# Altium project ECG_BLE.PrjPcb
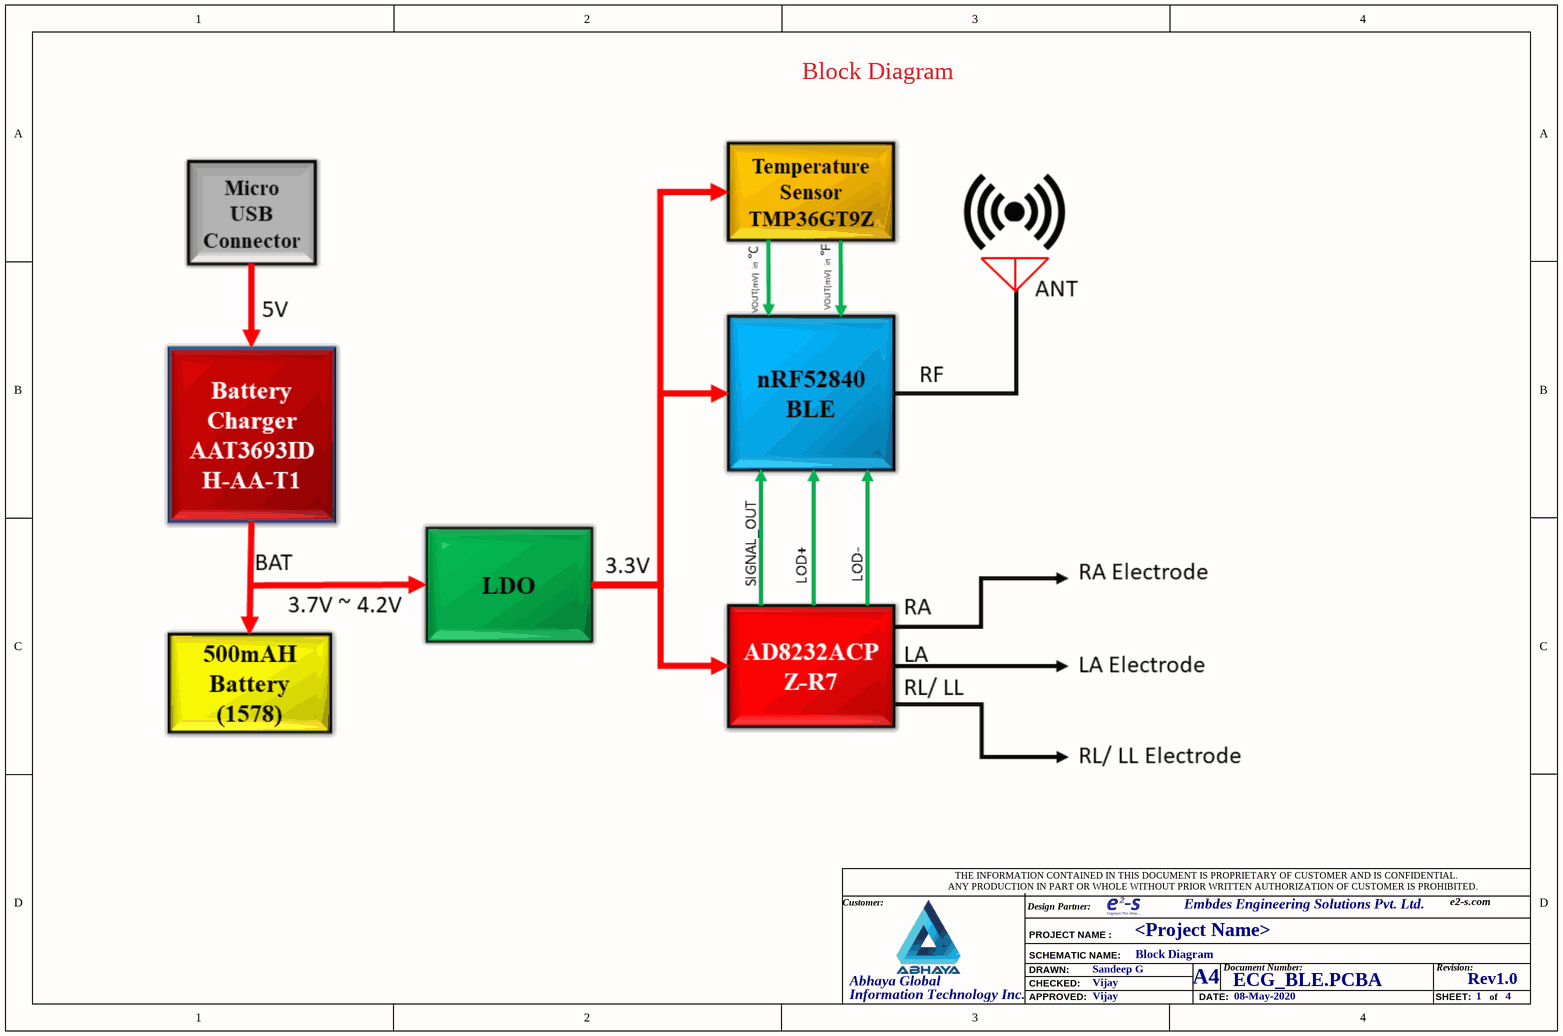
[diagram p0: Block Diagram.SchDoc]
4 sheets, 110 parts. Net scope: flat (ports and power ports of the same name join across sheets).
Board file: ECG_BLE.PcbDoc
Sheets:
  Block Diagram.SchDoc
  AD8232 & TMP136.SchDoc
  nRF52840.SchDoc
  USB & Battery Charging.SchDoc

## Sheet Block Diagram.SchDoc
size A4; Date: 08-May-2020; ApprovedBy: Vijay; CheckedBy: Vijay; CompanyName: Embdes Engineering Solutions Pvt. Ltd.; DrawnBy: Sandeep G; Organization: Altium Limited; Address1: e2-s.com; DocumentNumber: ECG_BLE.PCBA; Revision: Rev1.0; SheetNumber: 1; SheetTotal: 4; ApprovedByDate: <DATE>; CheckedByDate: <DATE>; DrawnByDate: <DATE>; PageName: Block Diagram; PageSetup: Record=PageOptions|CenterHorizontal=True|CenterVertical=True|PrintScale=0.71|XCorrection=1.00|YCorrection=1.00|PrintKind=1|BorderSize=5000000|LeftOffset=0|BottomOffset=0|Orientation=2|PaperLength=1000|PaperWidth=1000|Scale=100|PaperSource=15|PrintQuality=-4|MediaType=1|DitherType=10|PaperKind=Ledger.|PrintScaleMode=1; ProjectName: <Project Name>

### Notes on the sheet
- Block Diagram
- Customer:
- Design Partner:
- THE INFORMATION CONTAINED IN THIS DOCUMENT IS PROPRIETARY OF CUSTOMER AND IS CONFIDENTIAL.
- ANY PRODUCTION IN PART OR WHOLE WITHOUT PRIOR WRITTEN AUTHORIZATION OF CUSTOMER IS PROHIBITED.
- Abhaya Global
- DRAWN:
- CHECKED:
- PROJECT NAME :
- SCHEMATIC NAME:
- A4
- Document Number:
- Revision:
- Information Technology Inc.
- APPROVED:
- DATE:
- SHEET:
- of

## Sheet AD8232 & TMP136.SchDoc
size A4; Date: 08-May-2020; ApprovedBy: Vijay; CheckedBy: Vijay; CompanyName: Embdes Engineering Solutions Pvt. Ltd.; DrawnBy: Sandeep G; Organization: Altium Limited; Address1: e2-s.com; DocumentNumber: ECG_BLE.PCBA; Revision: Rev1.0; SheetNumber: 2; SheetTotal: 4; ApprovedByDate: <DATE>; CheckedByDate: <DATE>; DrawnByDate: <DATE>; PageName: AD8232 & TMP136; PageSetup: Record=PageOptions|CenterHorizontal=True|CenterVertical=True|PrintScale=0.71|XCorrection=1.00|YCorrection=1.00|PrintKind=1|BorderSize=5000000|LeftOffset=0|BottomOffset=0|Orientation=2|PaperLength=1000|PaperWidth=1000|Scale=100|PaperSource=15|PrintQuality=-4|MediaType=1|DitherType=10|PaperKind=Ledger.|PrintScaleMode=1; ProjectName: <Project Name>
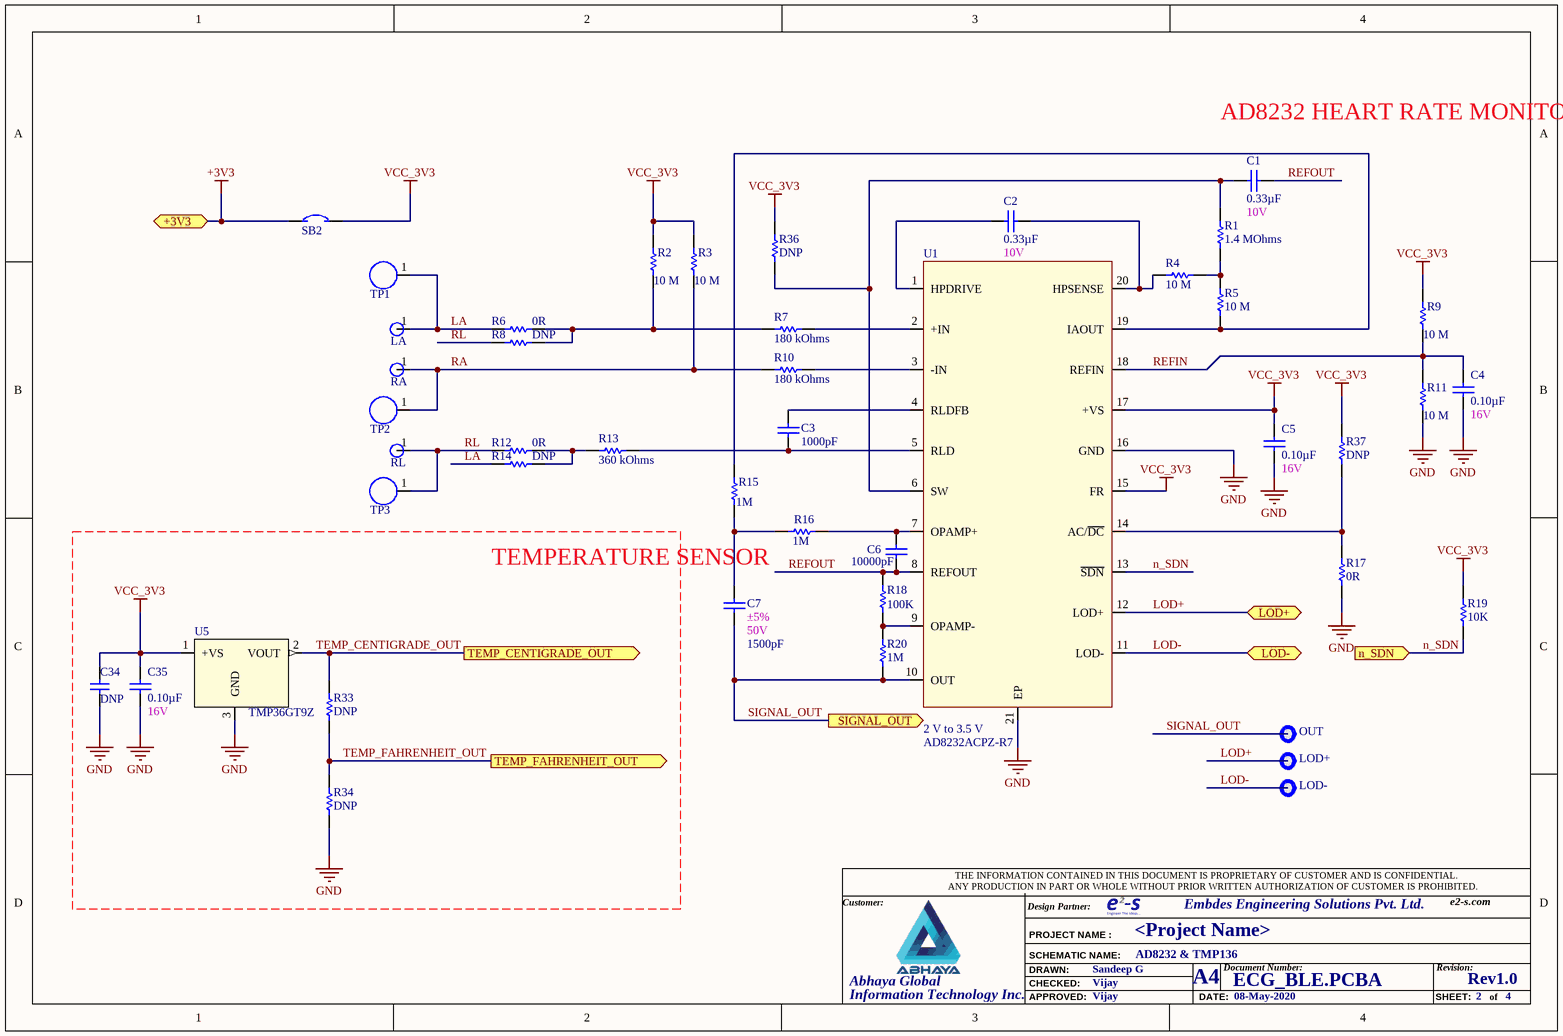
[diagram p1: AD8232 & TMP136.SchDoc]

### Parts
C1  value 0.33µF  1st Auxiliary Field: 10V  [SMDC0402]  (hidden comment: CAP CER 0.33UF 10V X5R 0402)
C2  value 0.33µF  1st Auxiliary Field: 10V  [SMDC0402]  (hidden comment: CAP CER 0.33UF 10V X5R 0402)
C3  value 1000pF  [SMDC0402]  (hidden comment: CAP CER 1000PF 50V X7R 0402)
C4  value 0.10µF  1st Auxiliary Field: 16V  [SMDC0402]  (hidden comment: CAP CER 0.1UF 16V X7R 0402)
C5  value 0.10µF  1st Auxiliary Field: 16V  [SMDC0402]  (hidden comment: CAP CER 0.1UF 16V X7R 0402)
C6  value 10000pF  [SMDCC0402]  (hidden comment: CAP CER 10000PF 50V X7R 0402)
C7  value 1500pF  2nd Auxiliary Field: ±5%  1st Auxiliary Field: 50V  [SMDC0402]  (hidden comment: CAP CER 1500PF 50V X7R 0402)
C34  value DNP  [SMDC0402]  (hidden comment: CAP CER 2.2UF 10V JB 0402)
C35  value 0.10µF  1st Auxiliary Field: 16V  [SMDC0402]  (hidden comment: CAP CER 0.1UF 16V X7R 0402)
LA  Test Point- 1.02mm Hole, 1.52mm Round Pad  [TP_1.02X1.52MM_TH]  (value not drawn)
LOD+  TEST POINT  [TP_40X40]  (value not drawn)
LOD-  TEST POINT  [TP_40X40]  (value not drawn)
OUT  TEST POINT  [TP_40X40]  (value not drawn)
R1  value 1.4 MOhms  [SMDR0402]  (hidden comment: RES 1.4M OHM 1% 1/16W 0402)
R2  value 10 M  [SMDR0402]  (hidden comment: RES SMD 10M OHM 5% 1/10W 0402)
R3  value 10 M  [SMDR0402]  (hidden comment: RES SMD 10M OHM 5% 1/10W 0402)
R4  value 10 M  [SMDR0402]  (hidden comment: RES SMD 10M OHM 5% 1/10W 0402)
R5  value 10 M  [SMDR0402]  (hidden comment: RES SMD 10M OHM 5% 1/10W 0402)
R6  value 0R  [SMDR0402]  (hidden comment: RES SMD 0.0OHM JUMPER 1/10W 0402)
R7  value 180 kOhms  [SMDR0402]  (hidden comment: RES SMD 180K OHM 1% 1/16W 0402)
R8  value DNP  [SMDR0402]  (hidden comment: RES SMD 0.0OHM JUMPER 1/10W 0402)
R9  value 10 M  [SMDR0402]  (hidden comment: RES SMD 10M OHM 5% 1/10W 0402)
R10  value 180 kOhms  [SMDR0402]  (hidden comment: RES SMD 180K OHM 1% 1/16W 0402)
R11  value 10 M  [SMDR0402]  (hidden comment: RES SMD 10M OHM 5% 1/10W 0402)
R12  value 0R  [SMDR0402]  (hidden comment: RES SMD 0.0OHM JUMPER 1/10W 0402)
R13  value 360 kOhms  [SMDR0402]  (hidden comment: RES SMD 360K OHM 1% 1/10W 0402)
R14  value DNP  [SMDR0402]  (hidden comment: RES SMD 0.0OHM JUMPER 1/10W 0402)
R15  value 1M  [SMDR0402]  (hidden comment: RES SMD 1M OHM 1% 1/10W 0402)
R16  value 1M  [SMDR0402]  (hidden comment: RES SMD 1M OHM 1% 1/10W 0402)
R17  value 0R  [SMDR0402]  (hidden comment: RES SMD 0.0OHM JUMPER 1/10W 0402)
R18  value 100K  [SMDRC0402]  (hidden comment: RES SMD 100K OHM 1% 1/10W 0402)
R19  value 10K  [SMDR0402]  (hidden comment: RES SMD 10K OHM 1% 1/10W 0402)
R20  value 1M  [SMDR0402]  (hidden comment: RES SMD 1M OHM 1% 1/10W 0402)
R33  value DNP  [SMDR0402]  (hidden comment: RES 45.3K OHM 0.5% 1/16W 0402)
R34  value DNP  [SMDR0402]  (hidden comment: RES SMD 10K OHM 0.5% 1/16W 0402)
R36  value DNP  [SMDR0402]  (hidden comment: RES SMD 0.0OHM JUMPER 1/10W 0402)
R37  value DNP  [SMDR0402]  (hidden comment: RES SMD 0.0OHM JUMPER 1/10W 0402)
RA  Test Point- 1.02mm Hole, 1.52mm Round Pad  [TP_1.02X1.52MM_TH]  (value not drawn)
RL  Test Point- 1.02mm Hole, 1.52mm Round Pad  [TP_1.02X1.52MM_TH]  (value not drawn)
SB2  EMS_SB0805  [SB_0805]  (value not drawn)  (net tie, no BOM)
TP1  Electrode point  [ELE-MH-6x8MM]  (value not drawn)
TP2  Electrode point  [ELE-MH-6x8MM]  (value not drawn)
TP3  Electrode point  [ELE-MH-6x8MM]  (value not drawn)
U1  value AD8232ACPZ-R7  1st Auxiliary Field: 2 V to 3.5 V  [QFN50P400X400X80_HS-21N]  (hidden comment: Analog Front End - AFE ECG and HRM IC Single Lead)
U5  value TMP36GT9Z  [TO-226-AA]  (hidden comment: SENSOR ANALOG -40C-125C TO92-3)

### Ports
+3V3, LOD+, LOD-, n_SDN (in), SIGNAL_OUT (out), TEMP_CENTIGRADE_OUT (out), TEMP_FAHRENHEIT_OUT (out)

### Nets
+3V3: SB2.1 ; port +3V3
GND: C4.1 C5.1 C34.1 C35.1 R11.1 R17.2 R34.1 U1.16(GND) U1.21(EP) U5.3(GND)
VCC_3V3: C5.2 C34.2 C35.2 R2.2 R3.2 R9.2 R19.1 R36.2 R37.1 SB2.2 U1.15(FR) U1.17(+VS) U5.1(+VS)
LA: LA.1 R6.1 R14.1 TP1.1
LOD+: LOD+.1 U1.12(LOD+) ; port LOD+
LOD-: LOD-.1 U1.11(LOD-) ; port LOD-
n_SDN: R19.2 U1.13(~{SDN}) ; port n_SDN
RA: R3.1 R10.1 RA.1 TP2.1
REFIN: C4.2 R9.1 R11.2 U1.18(REFIN)
REFOUT: C1.2 C6.1 R18.1 U1.8(REFOUT)
RL: R8.1 R12.1 RL.1 TP3.1
SIGNAL_OUT: C7.1 OUT.1 R20.2 U1.10(OUT) ; port SIGNAL_OUT
TEMP_CENTIGRADE_OUT: R33.2 U5.2(VOUT) ; port TEMP_CENTIGRADE_OUT
TEMP_FAHRENHEIT_OUT: R33.1 R34.2 ; port TEMP_FAHRENHEIT_OUT
NetC1_1: C1.1 R1.2 R36.1 U1.6(SW)
NetC2_1: C2.1 U1.1(HPDRIVE)
NetC2_2: C2.2 R4.2 U1.20(HPSENSE)
NetC3_1: C3.1 R13.2 U1.5(RLD)
NetC3_2: C3.2 U1.4(RLDFB)
NetC6_2: C6.2 R16.1 U1.7(OPAMP+)
NetC7_2: C7.2 R15.1 R16.2
NetR1_1: R1.1 R4.1 R5.1
NetR2_1: R2.1 R6.2 R7.1 R8.2
NetR5_2: R5.2 R15.2 U1.19(IAOUT)
NetR7_2: R7.2 U1.2(+IN)
NetR10_2: R10.2 U1.3(-IN)
NetR12_2: R12.2 R13.1 R14.2
NetR17_1: R17.1 R37.2 U1.14(AC/~{DC})
NetR18_2: R18.2 R20.1 U1.9(OPAMP-)

### Notes on the sheet
- AD8232 HEART RATE MONITOR
- TEMPERATURE SENSOR
- Customer:
- Design Partner:
- THE INFORMATION CONTAINED IN THIS DOCUMENT IS PROPRIETARY OF CUSTOMER AND IS CONFIDENTIAL.
- ANY PRODUCTION IN PART OR WHOLE WITHOUT PRIOR WRITTEN AUTHORIZATION OF CUSTOMER IS PROHIBITED.
- Abhaya Global
- DRAWN:
- CHECKED:
- PROJECT NAME :
- SCHEMATIC NAME:
- A4
- Document Number:
- Revision:
- Information Technology Inc.
- APPROVED:
- DATE:
- SHEET:
- of

### Library data of the parts
C1 C2 = ECA0U33L10V0-SB: Manufacturer: Samsung Electro-Mechanics; Manufacturer Part Number: CL05A334KP5NNNC; Vendor Part Number: 1276-6665-1-ND; Temp Co: -55°C ~ 85°C; 3rd Auxiliary Field: ROHS3 Compliant; Component Height (mm): 0.55mm; Vendor Name: Digi-Key; 2nd Auxiliary Field: ±10%; Internal Part Number: ECA0U33L10V0-SB; Part Type: CAP CER 0.33UF 10V X5R 0402; 4th Auxiliary Field: *
C3 = ECA1N00K50V0-SB: Manufacturer: KEMET; Manufacturer Part Number: C0402C102J5RACTU; Vendor Part Number: 399-7754-1-ND; Temp Co: -55°C ~ 125°C; 3rd Auxiliary Field: ROHS3 Compliant; Component Height (mm): 0.55mm; Vendor Name: Digi-Key; 2nd Auxiliary Field: ±5%; Internal Part Number: ECA1N00K50V0-SB; Part Type: CAP CER 1000PF 50V X7R 0402; 4th Auxiliary Field: *; 1st Auxiliary Field: 50V
C4 C5 C35 = ECA0U10K16V0-1-SB: Manufacturer: Samsung Electro-Mechanics America, Inc.; Manufacturer Part Number: CL05B104KO5NNNC; Vendor Part Number: 1276-1001-1-ND; Vendor Name: Digi-Key; 2nd Auxiliary Field: ±10%; Temp Co: X7R; Internal Part Number: ECA0U10K16V0-1-SB; 3rd Auxiliary Field: *; Component Height (mm): *; Part Type: CAP CER 0.1UF 16V X7R 0402; 4th Auxiliary Field: *
C6 = ECA10N0K50V0-SB: Manufacturer Part Number: C0402C103J5RACTU; Manufacturer: Samsung Electro-Mechanics America, Inc.; Vendor Part Number: 399-7758-1-ND; Component Height (mm): 0.55; 4th Auxiliary Field: RoHS Compliant; Vendor Name: Digi-Key; 2nd Auxiliary Field: ±5%; Internal Part Number: ECA10N0K50V0-SB; 3rd Auxiliary Field: *; Part Type: CAP CER 10000PF 50V X7R 0402; Temp Co: X7R; 1st Auxiliary Field: 50V
C7 = ECA1N50K50V0-SB: Manufacturer: Yageo; Vendor Part Number: 311-3763-1-ND; Manufacturer Part Number: CC0402JRX7R9BB152; Vendor Name: Digi-Key; 3rd Auxiliary Field: ROHS3 Compliant; Component Height (mm): 0.55mm; Temp Co: -55°C ~ 125°C; Part Type: CAP CER 1500PF 50V X7R 0402; Internal Part Number: ECA1N50K50V0-SB; 4th Auxiliary Field: *
C34 = ECA2U20L10V-SB: Manufacturer: TDK Corporation; Vendor Part Number: 445-10904-1-ND; Manufacturer Part Number: C1005JB1A225K050BC; 1st Auxiliary Field: 2.2µF; 3rd Auxiliary Field: RoHS Compliant; Component Height (mm): 0.55mm; Temperature Coefficient: -25°C ~ 85°C; Vendor Name: Digi-Key; 2nd Auxiliary Field: ±10%; Internal part Number: ECA2U20L10V-SB; Part Type: CAP CER 2.2UF 10V JB 0402; 4th Auxiliary Field: 10V
LA RA RL = EMS-TP_1X1.52MM_TH: Internal Part Number: EMS-TP_1X1.52MM_TH; Component Height (mm): *; Part Type: Test Point- 1.02mm Hole, 1.52mm Round Pad
LOD+ LOD- OUT = EMS-TP40X40-S: 1st Auxiliary Field: Black; Component Height (mm): *; Manufacturer: *; Part Type: TEST POINT; Manufacturer Part Number: *; Internal Part Number: EMS-TP40X40-S
R1 = ERE1M40G116-SB: Manufacturer: Stackpole Electronics Inc; Vendor Part Number: RMCF0402FT1M40CT-ND; Manufacturer Part Number: RMCF0402FT1M40; Vendor Name: Digi-Key; 3rd Auxiliary Field: ROHS3 Compliant; Component Height (mm): 0.40mm; Temp Co: -55°C ~ 155°C; 1st Auxiliary Field: 0.063W, 1/16W; Part Type: RES 1.4M OHM 1% 1/16W 0402; Internal Part Number: ERE1M40G116-SB; 4th Auxiliary Field: *; 2nd Auxiliary Field: ±1%
R2-R5 R9 R11 = ERE10M0K110-SB: Manufacturer Part Number: ERJ-2GEJ106X; Manufacturer: Panasonic Electronic Components; Vendor Part Number: P10MJCT-ND; 3rd Auxiliary Field: ROHS3 Compliant; Component Height (mm): 0.4mm; Temp Co: -55°C ~ 155°C; Vendor Name: Digi-Key; 1st Auxiliary Field: 0.1W; Internal Part Number: ERE10M0K110-SB; Part Type: RES SMD 10M OHM 5% 1/10W 0402; 4th Auxiliary Field: *; 2nd Auxiliary Field: ±5%
R6 R8 R12 R14 R17 R36 R37 = ERE0R00110-SB: Manufacturer: Panasonic Electronic Components; Vendor Part Number: P0.0JCT-ND; Manufacturer Part Number: ERJ-2GE0R00X; Vendor Name: Digi-Key; Component Height (mm): 0.40mm; 1st Auxiliary Field: 0.1W; Part Type: RES SMD 0.0OHM JUMPER 1/10W 0402; Internal Part Number: ERE0R00110-SB; Temp Co: *; 2nd Auxiliary Field: Jumper
R7 R10 = ERE180KG116-SB: Manufacturer: Yageo; Vendor Part Number: 311-180KLRCT-ND; Manufacturer Part Number: RC0402FR-07180KL; Vendor Name: Digi-Key; 3rd Auxiliary Field: ROHS3 Compliant; Component Height (mm): 0.40mm; Temp Co: -55°C ~ 155°C; 1st Auxiliary Field: 0.063W, 1/16W; Part Type: RES SMD 180K OHM 1% 1/16W 0402; Internal Part Number: ERE180KG116-SB; 4th Auxiliary Field: *; 2nd Auxiliary Field: ±1%
R13 = ERE360KG110-SB: Manufacturer: Panasonic Electronic Components; Vendor Part Number: P360KLCT-ND; Manufacturer Part Number: ERJ-2RKF3603X; Vendor Name: Digi-Key; 3rd Auxiliary Field: ROHS3 Compliant; Component Height (mm): 0.40mm; Temp Co: -55°C ~ 155°C; 1st Auxiliary Field: 0.1W, 1/10W; Part Type: RES SMD 360K OHM 1% 1/10W 0402; Internal Part Number: ERE360KG110-SB; 4th Auxiliary Field: *; 2nd Auxiliary Field: ±1%
R15 R16 R20 = ERE1M00G110-SB: Manufacturer Part Number: ERJ-2RKF1004X; Manufacturer: Panasonic Electronic Components; Vendor Part Number: P1.00MLCT-ND; Component Height (mm): 0.40mm; Temp Co: -55°C ~ 155°C; Vendor Name: Digi-Key; 1st Auxiliary Field: 0.1W; Internal Part Number: ERE1M00G110-SB; 3rd Auxiliary Field: *; Part Type: RES SMD 1M OHM 1% 1/10W 0402; 4th Auxiliary Field: *; 2nd Auxiliary Field: ±1%
R18 = ERE100KG110-SB: Manufacturer Part Number: ERJ-2RKF1003X; Manufacturer: Panasonic Electronic Components; Vendor Part Number: P100KLCT-ND; Component Height (mm): 0.40mm; Vendor Name: Digi-Key; Temp Co: ±100ppm/°C; 1st Auxiliary Field: 0.1W; Part Type: RES SMD 100K OHM 1% 1/10W 0402; 3rd Auxiliary Field: *; 4th Auxiliary Field: *; Internal Part Number: ERE100KG110-SB; 2nd Auxiliary Field: ±1%
R19 = ERE10K0G110-SB: Manufacturer: Panasonic Electronic Components; Manufacturer Part Number: ERJ-2RKF1002X; Vendor Part Number: P10.0KLCT-ND; Component Height (mm): 0.40mm; Vendor Name: Digi-Key; Temp Co: ±100ppm/°C; 1st Auxiliary Field: 0.1W; Part Type: RES SMD 10K OHM 1% 1/10W 0402; Internal Part Number: ERE10K0G110-SB; 2nd Auxiliary Field: ±1%
R33 = ERE45K3F116-SB: Manufacturer: Stackpole Electronics Inc; Vendor Part Number: RNCF0402DTE45K3CT-ND; Manufacturer Part Number: RNCF0402DTE45K3; Vendor Name: Digi-Key; 3rd Auxiliary Field: ROHS3 Compliant; Component Height (mm): 0.35mm; Temp Co: -55°C ~ 155°C; 1st Auxiliary Field: 0.063W, 1/16W; Part Type: RES 45.3K OHM 0.5% 1/16W 0402; Internal Part Number: ERE45K3F116-SB; 4th Auxiliary Field: *; 2nd Auxiliary Field: ±0.5%
R34 = ERE10K0F116-SB: Manufacturer: Panasonic Electronic Components; Vendor Part Number: P15984CT-ND; Manufacturer Part Number: ERJ-2RHD1002X; Vendor Name: Digi-Key; 3rd Auxiliary Field: ROHS3 Compliant; Component Height (mm): 0.40mm; Temp Co: -55°C ~ 125°C; 1st Auxiliary Field: 0.063W, 1/16W; Part Type: RES SMD 10K OHM 0.5% 1/16W 0402; Internal Part Number: ERE10K0F116-SB; 4th Auxiliary Field: *; 2nd Auxiliary Field: ±0.5%
SB2 = EMS_SB0805: *; Manufacturer: *; Part Type: *; Vendor Name: *; Vendor Part Number: *; 3rd Auxiliary Field: *; Manufacturer Part Number: *; Internal Part Number: EMS_SB0805; 4th Auxiliary Field: *; Component Height (mm): *; Temp Co: *; 2nd Auxiliary Field: *; 1st Auxiliary Field: *; Value: *
TP1-TP3 = EMS-ELE_6X8MM_TH: Internal Part Number: EMS-ELE_6X8MM_TH; Component Height (mm): *; Part Type: Electrode point
U1 = EICADLFCSP-20-1862: Manufacturer: Analog Devices; Vendor Part Number: 584-AD8232ACPZ-R7; 2nd Auxiliary Field: 170 uA; 3rd Auxiliary Field: RoHS Compliant; Component Height (mm): 0.8mm; Temp Co: -40°C ~ 85°C; Vendor Name: Mouser; 4th Auxiliary Field: *; Internal Part Number: EICADLFCSP-20-1862; Part Type: Analog Front End - AFE ECG and HRM IC Single Lead; Manufacturer Part Number: AD8232ACPZ-R7
U5 = EICADTO92-3-1865: Manufacturer: Analog Devices Inc.; Vendor Part Number: TMP36GT9Z-ND; 2nd Auxiliary Field: 10mV/°C; 3rd Auxiliary Field: RoHS Compliant; Component Height (mm): 18.03mm; Temp Co: 25°C (-40°C ~ 125°C); Vendor Name: Digi-Key; 1st Auxiliary Field: 2.7V ~ 5.5V; 4th Auxiliary Field: *; Internal Part Number: EICADTO92-3-1865; Part Type: SENSOR ANALOG -40C-125C TO92-3; Manufacturer Part Number: TMP36GT9Z

## Sheet nRF52840.SchDoc
size A4; Date: 08-May-2020; ApprovedBy: Vijay; CheckedBy: Vijay; CompanyName: Embdes Engineering Solutions Pvt. Ltd.; DrawnBy: Sandeep G; Organization: Altium Limited; Address1: e2-s.com; DocumentNumber: ECG_BLE.PCBA; Revision: Rev1.0; SheetNumber: 3; SheetTotal: 4; ApprovedByDate: <DATE>; CheckedByDate: <DATE>; DrawnByDate: <DATE>; PageName: nRF52840; PageSetup: Record=PageOptions|CenterHorizontal=True|CenterVertical=True|PrintScale=0.71|XCorrection=1.00|YCorrection=1.00|PrintKind=1|BorderSize=5000000|LeftOffset=0|BottomOffset=0|Orientation=2|PaperLength=1000|PaperWidth=1000|Scale=100|PaperSource=15|PrintQuality=-4|MediaType=1|DitherType=10|PaperKind=Ledger.|PrintScaleMode=1; ProjectName: <Project Name>
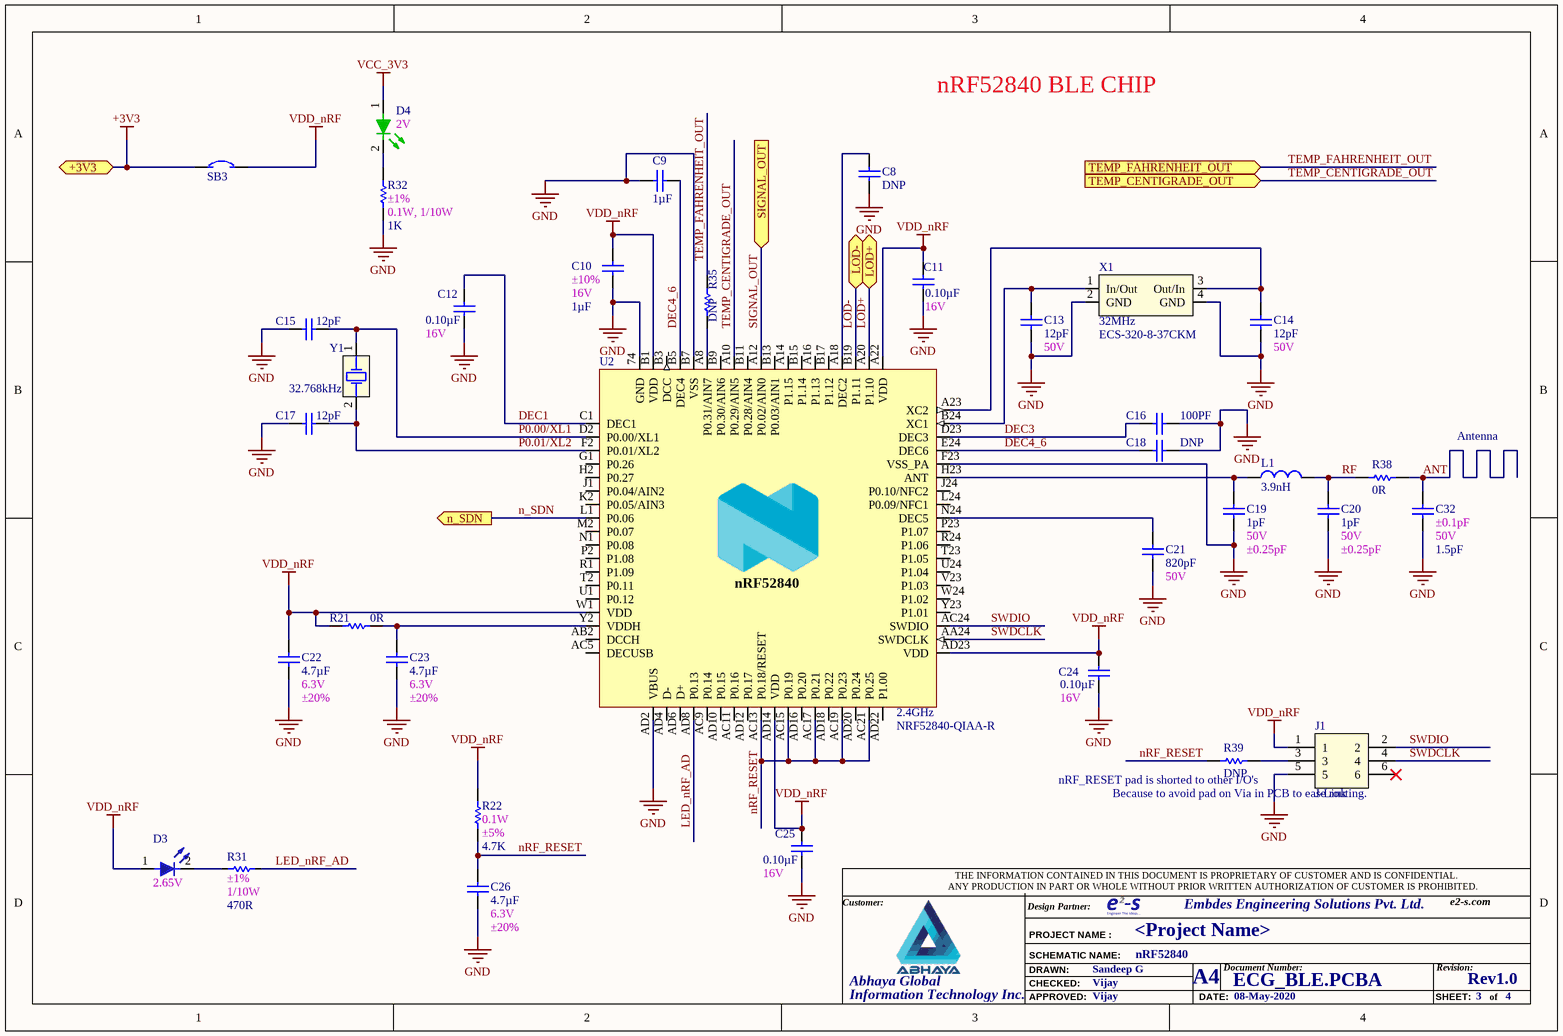
[diagram p2: nRF52840.SchDoc]

### Parts
C8  value DNP  [SMDC0402]  (hidden comment: CAP CER 100PF 25V X7RCAP CER 100PF 25V C0G/NP0 0402 0402)
C9  value 1µF  [SMDC0402]  (hidden comment: CAP CER 1UF 16V X5R 0402)
C10  value 1µF  2nd Auxiliary Field: ±10%  1st Auxiliary Field: 16V  [SMDC0402]  (hidden comment: CAP CER 1UF 16V X5R 0402)
C11  value 0.10µF  1st Auxiliary Field: 16V  [SMDC0402]  (hidden comment: CAP CER 0.1UF 16V X7R 0402)
C12  value 0.10µF  1st Auxiliary Field: 16V  [SMDC0402]  (hidden comment: CAP CER 0.1UF 16V X7R 0402)
C13  value 12pF  1st Auxiliary Field: 50V  [SMDC0402]  (hidden comment: CAP CER 12PF 50V C0G/NP0 0402)
C14  value 12pF  1st Auxiliary Field: 50V  [SMDC0402]  (hidden comment: CAP CER 12PF 50V C0G/NP0 0402)
C15  value 12pF  [SMDC0402]  (hidden comment: CAP CER 12PF 50V C0G/NP0 0402)
C16  value 100PF  [SMDC0402]  (hidden comment: CAP CER 100PF 25V X7RCAP CER 100PF 25V C0G/NP0 0402 0402)
C17  value 12pF  [SMDC0402]  (hidden comment: CAP CER 12PF 50V C0G/NP0 0402)
C18  value DNP  [SMDC0402]  (hidden comment: CAP CER 100PF 25V X7RCAP CER 100PF 25V C0G/NP0 0402 0402)
C19  value 1pF  1st Auxiliary Field: 50V  2nd Auxiliary Field: ±0.25pF  [SMDC0402]  (hidden comment: CAP CER 1PF 50V C0G/NP0 0402)
C20  value 1pF  1st Auxiliary Field: 50V  2nd Auxiliary Field: ±0.25pF  [SMDC0402]  (hidden comment: CAP CER 1PF 50V C0G/NP0 0402)
C21  value 820pF  1st Auxiliary Field: 50V  [SMDC0402]  (hidden comment: CAP CER 820PF 50V C0G/NP0 0402)
C22  value 4.7µF  1st Auxiliary Field: 6.3V  2nd Auxiliary Field: ±20%  [SMDC0402]  (hidden comment: CAP CER 4.7UF 6.3V X5R 0402)
C23  value 4.7µF  1st Auxiliary Field: 6.3V  2nd Auxiliary Field: ±20%  [SMDC0402]  (hidden comment: CAP CER 4.7UF 6.3V X5R 0402)
C24  value 0.10µF  1st Auxiliary Field: 16V  [SMDC0402]  (hidden comment: CAP CER 0.1UF 16V X7R 0402)
C25  value 0.10µF  1st Auxiliary Field: 16V  [SMDC0402]  (hidden comment: CAP CER 0.1UF 16V X7R 0402)
C26  value 4.7µF  1st Auxiliary Field: 6.3V  2nd Auxiliary Field: ±20%  [SMDC0402]  (hidden comment: CAP CER 4.7UF 6.3V X5R 0402)
C32  value 1.5pF  2nd Auxiliary Field: ±0.1pF  1st Auxiliary Field: 50V  [SMDC0402]  (hidden comment: CAP CER 1.5PF 50V NP0 0402)
D3  1st Auxiliary Field: 2.65V  [SMDLED0603]  (hidden comment: LED BLUE CLEAR 2SMD)
D4  1st Auxiliary Field: 2V  [SMDLED0603]  (hidden comment: LED GREEN CLEAR SMD)
J1  1st Auxiliary Field: J-Link  [PRG_8.06.16 J-LINK 6-PIN NEEDLE ADAPTER]  (hidden comment: J-LINK 6-PIN NEEDLE ADAPTER)
L1  value 3.9nH  [SMDL0402]  (hidden comment: FIXED IND 3.9NH 170MA 500 MOHM)
R21  value 0R  [SMDR0402]  (hidden comment: RES SMD 0.0OHM JUMPER 1/10W 0402)
R22  value 4.7K  1st Auxiliary Field: 0.1W  2nd Auxiliary Field: ±5%  [SMDR0402]  (hidden comment: RES SMD 4.7K OHM 5% 1/10W 0402)
R31  value 470R  1st Auxiliary Field: ±1%  2nd Auxiliary Field: 1/10W  [SMDR0402]  (hidden comment: RES SMD 470 OHM 1% 1/10W 0402)
R32  value 1K  2nd Auxiliary Field: ±1%  1st Auxiliary Field: 0.1W, 1/10W  [SMDR0402]  (hidden comment: RES SMD 1K OHM 1% 1/10W 0402)
R35  value DNP  [SMDR0402]  (hidden comment: RES SMD 0.0OHM JUMPER 1/10W 0402)
R38  value 0R  [SMDR0402]  (hidden comment: RES SMD 0.0OHM JUMPER 1/10W 0402)
R39  value DNP  [SMDR0402]  (hidden comment: RES SMD 0.0OHM JUMPER 1/10W 0402)
SB3  EMS_SB0805  [SB_0805]  (value not drawn)  (net tie, no BOM)
U2  value NRF52840-QIAA-R  1st Auxiliary Field: 2.4GHz  [AQFN50P700X700X85_HS-74N]  (hidden comment: IC RF TXRX+MCU 802.15.4 73VFQFN)
X1  value ECS-320-8-37CKM  1st Auxiliary Field: 32MHz  [XTAL200X160X50-4N]  (hidden comment: CRYSTAL 32.0000MHZ 8PF SMD)
Y1  1st Auxiliary Field: 32.768kHz  [XTAL325X155X80N]  (hidden comment: CRYSTAL 32.7680KHZ 12.5PF SMD)

### Ports
+3V3, LOD+, LOD-, n_SDN (out), SIGNAL_OUT (in), TEMP_CENTIGRADE_OUT (in), TEMP_FAHRENHEIT_OUT (in)

### Nets
+3V3: SB3.1 ; port +3V3
GND: C8.2 C9.1 C10.1 C11.1 C12.1 C13.1 C14.1 C15.1 C16.2 C17.1 C18.2 C19.1 C20.1 C21.1 C22.1 C23.1 C24.1 C25.1 C26.1 C32.1 J1.5 R32.2 U2.74(GND) U2.AD2(VBUS) U2.B7(VSS) U2.F23(VSS_PA) X1.2(GND) X1.4(GND)
VCC_3V3: D4.1(A)
VDD_nRF: C10.2 C11.2 C22.2 C24.2 C25.2 D3.1(A) J1.1 R21.1 R22.2 SB3.2 U2.A22(VDD) U2.AD14(VDD) U2.AD23(VDD) U2.B1(VDD) U2.W1(VDD)
ANT: C32.2 R38.2
DEC1: C12.2 U2.C1(DEC1)
DEC3: C16.1 U2.D23(DEC3)
DEC4_6: C9.2 C18.1 U2.B5(DEC4) U2.E24(DEC6)
LED_nRF_AD: R31.1 U2.AD8(P0.13)
LOD+: U2.A20(P1.10) ; port LOD+
LOD-: U2.B19(P1.11) ; port LOD-
n_SDN: U2.L1(P0.06) ; port n_SDN
nRF_RESET: C26.2 R22.1 R39.1 U2.AC13(P0.18/RESET) U2.AC15(P0.19) U2.AC17(P0.21) U2.AC19(P0.23) U2.AC21(P0.25)
P0.00/XL1: C15.2 U2.D2(P0.00/XL1) Y1.1
P0.01/XL2: C17.2 U2.F2(P0.01/XL2) Y1.2
RF: C20.2 L1.2 R38.1
SIGNAL_OUT: U2.A12(P0.02/AIN0) ; port SIGNAL_OUT
SWDCLK: J1.4 U2.AA24(SWDCLK)
SWDIO: J1.2 U2.AC24(SWDIO)
TEMP_CENTIGRADE_OUT: U2.A10(P0.29/AIN5) ; port TEMP_CENTIGRADE_OUT
TEMP_FAHRENHEIT_OUT: R35.2 ; port TEMP_FAHRENHEIT_OUT
NetC8_1: C8.1 U2.A18(DEC2)
NetC13_2: C13.2 U2.B24(XC1) X1.1(In/Out)
NetC14_2: C14.2 U2.A23(XC2) X1.3(Out/In)
NetC19_2: C19.2 L1.1 U2.H23(ANT)
NetC21_2: C21.2 U2.N24(DEC5)
NetC23_2: C23.2 R21.2 U2.Y2(VDDH)
NetD3_2: D3.2(K) R31.2
NetD4_2: D4.2(K) R32.1
NetJ1_3: J1.3 R39.2
NetR35_1: R35.1 U2.A8(P0.31/AIN7)

Not connected (* = marked no-connect by the designer): J1 6*; U2 A14(P1.15) A16(P1.13) AB2(DCCH) AC5(DECUSB) AC9(P0.14) AC11(P0.16) AD4(D-) AD6(D+) AD10(P0.15) AD12(P0.17) AD16(P0.20) AD18(P0.22) AD20(P0.24) AD22(P1.00) B3(DCC) B9(P0.30/AIN6) B11(P0.28/AIN4) B13(P0.03/AIN1) B15(P1.14) B17(P1.12) G1(P0.26) H2(P0.27) J1(P0.04/AIN2) J24(P0.10/NFC2) K2(P0.05/AIN3) L24(P0.09/NFC1) M2(P0.07) N1(P0.08) P2(P1.08) P23(P1.07) R1(P1.09) R24(P1.06) T2(P0.11) T23(P1.05) U1(P0.12) U24(P1.04) V23(P1.03) W24(P1.02) Y23(P1.01)

### Notes on the sheet
- nRF52840 BLE CHIP
- Antenna
- nRF_RESET pad is shorted to other I/O's
- (near C25) Because to avoid pad on Via in PCB to ease routing.
- Customer:
- Design Partner:
- THE INFORMATION CONTAINED IN THIS DOCUMENT IS PROPRIETARY OF CUSTOMER AND IS CONFIDENTIAL.
- ANY PRODUCTION IN PART OR WHOLE WITHOUT PRIOR WRITTEN AUTHORIZATION OF CUSTOMER IS PROHIBITED.
- Abhaya Global
- DRAWN:
- CHECKED:
- PROJECT NAME :
- SCHEMATIC NAME:
- A4
- Document Number:
- Revision:
- Information Technology Inc.
- APPROVED:
- DATE:
- SHEET:
- of
- (in symbol EICNSVFQFN-73-1863) nRF52840

### Library data of the parts
C8 C18 = ECA100P0K25V0-SB: CAP CER 100PF 25V C0G/NP0 0402; Manufacturer: KEMET; Vendor Part Number: 399-1022-1-ND; Vendor Name: Digi-Key; 3rd Auxiliary Field: ROHS3 Compliant; Component Height (mm): 0.55mm; Temp Co: -55°C ~ 125°C; 2nd Auxiliary Field: ±5%; Part Type: CAP CER 100PF 25V C0G/NP0 0402; Manufacturer Part Number: DNP; Internal Part Number: ECA100P0K25V0-SB; 1st Auxiliary Field: 25V
C9 = ECA1U00L16V0-SB: Manufacturer: Samsung Electro-Mechanics; Vendor Part Number: 1276-1067-1-ND; Manufacturer Part Number: CL05A105KO5NNNC; Vendor Name: Digi-Key; 3rd Auxiliary Field: RoHS Compliant; Component Height (mm): 0.55MM; 2nd Auxiliary Field: ±10%; Part Type: CAP CER 1UF 16V X5R 0402; Internal Part Number: ECA1U00L16V0-SB; 4th Auxiliary Field: *; Temp Co: X5R; 1st Auxiliary Field: 16V
C10 = ECA1U00L16V0-SB: Manufacturer: Samsung Electro-Mechanics; Vendor Part Number: 1276-1067-1-ND; Manufacturer Part Number: CL05A105KO5NNNC; Vendor Name: Digi-Key; 3rd Auxiliary Field: RoHS Compliant; Component Height (mm): 0.55MM; Part Type: CAP CER 1UF 16V X5R 0402; Internal Part Number: ECA1U00L16V0-SB; 4th Auxiliary Field: *; Temp Co: X5R
C11 C12 C24 C25 = ECA0U10K16V0-1-SB: as C4 on sheet AD8232 & TMP136; Temp Co: X7R; Internal Part Number: ECA0U10K16V0-1-SB; 3rd Auxiliary Field: *; Component Height (mm): *; Part Type: CAP CER 0.1UF 16V X7R 0402; 4th Auxiliary Field: *
C13-C15 C17 = ECA12P0K50V0-SB: Manufacturer: KEMET; Manufacturer Part Number: CBR04C120J5GAC; Vendor Part Number: 399-6169-1-ND; Temp Co: -55°C ~ 125°C; 3rd Auxiliary Field: RoHS Compliant; Component Height (mm): 0.55mm; Vendor Name: Digi-Key; 2nd Auxiliary Field: ±5%; Internal Part Number: ECA12P0K50V0-SB; Part Type: CAP CER 12PF 50V C0G/NP0 0402; 4th Auxiliary Field: *
  C15 C17: 1st Auxiliary Field: 50V
C16 = ECA100P0K25V0-SB: CAP CER 100PF 25V C0G/NP0 0402; Manufacturer: KEMET; Vendor Part Number: 399-1022-1-ND; Manufacturer Part Number: C0402C101J3GACTU; Vendor Name: Digi-Key; 3rd Auxiliary Field: ROHS3 Compliant; Component Height (mm): 0.55mm; Temp Co: -55°C ~ 125°C; 2nd Auxiliary Field: ±5%; Part Type: CAP CER 100PF 25V C0G/NP0 0402; Internal Part Number: ECA100P0K25V0-SB; 1st Auxiliary Field: 25V
C19 C20 = ECA1P00V50V0-SB: Manufacturer: Samsung Electro-Mechanics; Manufacturer Part Number: CL05C010CB5NNNC; Vendor Part Number: 1276-1595-1-ND; Temp Co: -55°C ~ 125°C; 3rd Auxiliary Field: RoHS Compliant; Component Height (mm): 0.55mm; Vendor Name: Digi-Key; Internal Part Number: ECA1P00V50V0-SB; Part Type: CAP CER 1PF 50V C0G/NP0 0402; 4th Auxiliary Field: *
C21 = ECA820PK50V0-SB: Manufacturer: Samsung Electro-Mechanics; Manufacturer Part Number: CL05C821JB5NNNC; Vendor Part Number: 1276-1727-1-ND; Temp Co: -55°C ~ 125°C; 3rd Auxiliary Field: ROHS3 Compliant; Component Height (mm): 0.55mm; Vendor Name: Digi-Key; 2nd Auxiliary Field: ±5%; Internal Part Number: ECA820PK50V0-SB; Part Type: CAP CER 820PF 50V C0G/NP0 0402; 4th Auxiliary Field: *
C22 C23 C26 = ECA4U70N6V30-SB: Manufacturer: Murata Electronics North America; Manufacturer Part Number: GRM155R60J475ME47D; Vendor Part Number: 490-5915-1-ND; Temp Co: -55°C ~ 85°C; 3rd Auxiliary Field: RoHS Compliant; Component Height (mm): 0.60mm; Vendor Name: Digi-Key; Internal Part Number: ECA4U70N6V30-SB; Part Type: CAP CER 4.7UF 6.3V X5R 0402; 4th Auxiliary Field: *
C32 = ECA1P50D50V0-SB: Manufacturer: Murata Electronics North America; Vendor Part Number: 490-8087-1-ND; Manufacturer Part Number: GJM1555C1H1R5BB01D; Vendor Name: Digi-Key; Temp Co: C0G, NP0; Part Type: CAP CER 1.5PF 50V NP0 0402; 3rd Auxiliary Field: *; Internal Part Number: ECA1P50D50V0-SB; 4th Auxiliary Field: *; Component Height (mm): *
D3 = ELDB2V652M00-SC: Manufacturer: Kingbright; Vendor Part Number: 754-1933-1-ND; Manufacturer Part Number: APT1608LVBC/D; Vendor Name: Digi-Key; 2nd Auxiliary Field: 2mA; 3rd Auxiliary Field: RoHS Compliant; Component Height (mm): 0.75mm; Value: APT1608LVBC/D; Part Type: LED BLUE CLEAR 2SMD; Internal Part Number: ELDB2V652M00-SC; 4th Auxiliary Field: *; Temp Co: *
D4 = ELDG2V0020M0-SC: Manufacturer: Lite-On Inc.; Vendor Part Number: 160-1446-1-ND; Manufacturer Part Number: LTST-C191KGKT; Vendor Name: Digi-Key; 2nd Auxiliary Field: 20mA; 3rd Auxiliary Field: RoHS Compliant; Component Height (mm): 0.55mm; Value: LTST-C191KGKT; Part Type: LED GREEN CLEAR SMD; Internal Part Number: ELDG2V0020M0-SC; 4th Auxiliary Field: *; Temp Co: *
J1 = EMS-8.06.16 J-LINK 6-PIN NEEDLE ADAPTER: Manufacturer: Segger Microcontroller Systems; Vendor Part Number: 899-1051-ND; 3rd Auxiliary Field: RoHS Compliant; Vendor Name: Digi-Key; 2nd Auxiliary Field: *; 4th Auxiliary Field: *; Internal Part Number: EMS-8.06.16 J-LINK 6-PIN NEEDLE ADAPTER; Part Type: J-LINK 6-PIN NEEDLE ADAPTER; Temp Co: *; Manufacturer Part Number: 8.06.16 J-LINK 6-PIN NEEDLE ADAPTER; Value: 8.06.16 J-LINK 6-PIN NEEDLE ADAPTER
L1 = EIN3N90T170M-SB: Manufacturer Part Number: LQP15MN3N9B02D; Manufacturer: Murata Electronics North America; Vendor Part Number: 490-1131-1-ND; 3rd Auxiliary Field: RoHS Compliant; Component Height (mm): 0.45mm; Temp Co: -40°C ~ 85°C; Vendor Name: Digi-Key; 2nd Auxiliary Field: 500 mOhm Max; Internal Part Number: EIN3N90T170M-SB; Part Type: FIXED IND 3.9NH 170MA 500 MOHM; 4th Auxiliary Field: *; 1st Auxiliary Field: 170mA
R21 R35 R38 = ERE0R00110-SB: as R6 on sheet AD8232 & TMP136; Part Type: RES SMD 0.0OHM JUMPER 1/10W 0402; Internal Part Number: ERE0R00110-SB; Temp Co: *; 2nd Auxiliary Field: Jumper
R22 = ERE4K70J110-SB: Manufacturer Part Number: ERJ-2GEJ472X; Manufacturer: Panasonic Electronic Components; Vendor Part Number: P4.7KJCT-ND; Component Height (mm): 0.40mm; Temp Co: ±200ppm/°C; Vendor Name: Digi-Key; Internal Part Number: ERE4K70J110-SB; 3rd Auxiliary Field: *; Part Type: RES SMD 4.7K OHM 5% 1/10W 0402; 4th Auxiliary Field: *
R31 = ERE470RG110-SB: Manufacturer Part Number: ERJ-2RKF4700X; Manufacturer: Panasonic Electronic Components; Vendor Part Number: P470LCT-ND; Component Height (mm): 0.40mm; Temp Co: ±100ppm/°C; Vendor Name: Digi-Key; 3rd Auxiliary Field: *; Internal Part Number: ERE470RG110-SB; Part Type: RES SMD 470 OHM 1% 1/10W 0402; 4th Auxiliary Field: *
R32 = ERE1K00G110-SB_1: Manufacturer: Panasonic Electronic Components; Vendor Part Number: P1.00KLCT-ND; Manufacturer Part Number: ERJ-2RKF1001X; Vendor Name: Digi-Key; 3rd Auxiliary Field: RoHS Compliant; Component Height (mm): 0.40mm; Temp Co: ±100ppm/°C; Part Type: RES SMD 1K OHM 1% 1/10W 0402; Internal Part Number: ERE1K00G110-SB
R39 = ERE0R00110-SB: Manufacturer: Panasonic Electronic Components; Vendor Part Number: P0.0JCT-ND; Vendor Name: Digi-Key; Component Height (mm): 0.40mm; 1st Auxiliary Field: 0.1W; Part Type: RES SMD 0.0OHM JUMPER 1/10W 0402; Manufacturer Part Number: DNP; Internal Part Number: ERE0R00110-SB; Temp Co: *; 2nd Auxiliary Field: Jumper
SB3 = EMS_SB0805: *; Manufacturer: *; Part Type: *; Vendor Name: *; Vendor Part Number: *; 3rd Auxiliary Field: *; Manufacturer Part Number: *; Internal Part Number: EMS_SB0805; 4th Auxiliary Field: *; Component Height (mm): *; Temp Co: *; 2nd Auxiliary Field: *; 1st Auxiliary Field: *; Value: *
U2 = EICNSVFQFN-73-1863: Manufacturer: Nordic Semiconductor ASA; Vendor Part Number: 1490-1071-1-ND; 2nd Auxiliary Field: 1.7V ~ 5.5V; 3rd Auxiliary Field: ROHS3 Compliant; 4th Auxiliary Field: 2Mbps; Component Height (mm): 0.85mm; Temp Co: -40°C ~ 85°C; Vendor Name: Digi-Key; Internal Part Number: EICNSVFQFN-73-1863; Part Type: IC RF TXRX+MCU 802.15.4 73VFQFN; Manufacturer Part Number: NRF52840-QIAA-R
X1 = EMS-ECS-320-8-37CKM: Manufacturer: ECS Inc.; Vendor Part Number: XC1547CT-ND; 3rd Auxiliary Field: RoHS Compliant; Component Height (mm): 0.55mm; Temp Co: -20°C ~ 70°C; Vendor Name: Digi-Key; 2nd Auxiliary Field: 8pF; 4th Auxiliary Field: *; Internal Part Number: EMS-ECS-320-8-37CKM; Part Type: CRYSTAL 32.0000MHZ 8PF SMD; Manufacturer Part Number: ECS-320-8-37CKM
Y1 = EMS-ABS07-32.768KHZ-T: Manufacturer: Abracon LLC; Vendor Part Number: 535-9542-1-ND; 2nd Auxiliary Field: ±20ppm; 3rd Auxiliary Field: RoHS Compliant; Component Height (mm): 0.9mm; Temp Co: -40°C ~ 85°C; Vendor Name: Digi-Key; 4th Auxiliary Field: *; Internal Part Number: EMS-ABS07-32.768KHZ-T; Part Type: CRYSTAL 32.7680KHZ 12.5PF SMD; Manufacturer Part Number: ABS07-32.768KHZ-T; Value: ABS07-32.768KHZ-T

## Sheet USB & Battery Charging.SchDoc
size A4; Date: 08-May-2020; ApprovedBy: Vijay; CheckedBy: Vijay; CompanyName: Embdes Engineering Solutions Pvt. Ltd.; DrawnBy: Sandeep G; Organization: Altium Limited; Address1: e2-s.com; DocumentNumber: ECG_BLE.PCBA; Revision: Rev1.0; SheetNumber: 4; SheetTotal: 4; ApprovedByDate: <DATE>; CheckedByDate: <DATE>; DrawnByDate: <DATE>; PageName: USB & Battery Charging; PageSetup: Record=PageOptions|CenterHorizontal=True|CenterVertical=True|PrintScale=0.71|XCorrection=1.00|YCorrection=1.00|PrintKind=1|BorderSize=5000000|LeftOffset=0|BottomOffset=0|Orientation=2|PaperLength=1000|PaperWidth=1000|Scale=100|PaperSource=15|PrintQuality=-4|MediaType=1|DitherType=10|PaperKind=Ledger.|PrintScaleMode=1; ProjectName: <Project Name>
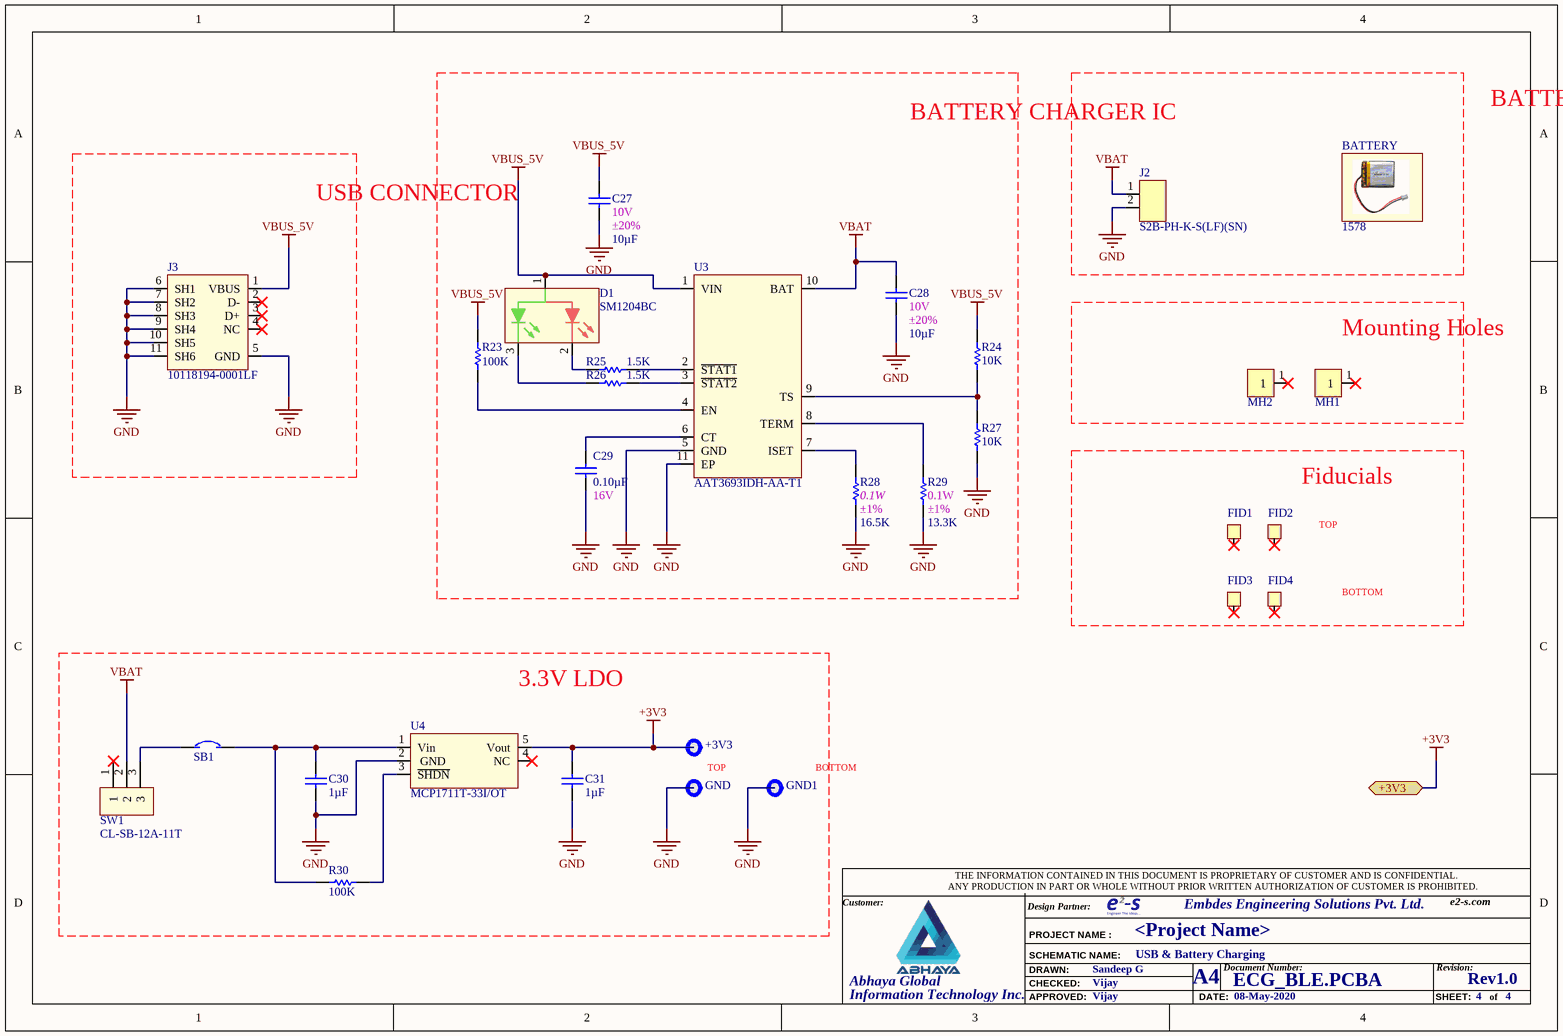
[diagram p3: USB & Battery Charging.SchDoc]

### Parts
+3V3  TEST POINT  [TP_40X40]  (value not drawn)
BATTERY  value 1578  (hidden comment: BATTERY LITHIUM 3.7V 500MAH)  (graphical)
C27  value 10µF  1st Auxiliary Field: 10V  2nd Auxiliary Field: ±20%  [SMDC0402]  (hidden comment: CAP CER 10UF 10V X5R 0402)
C28  value 10µF  1st Auxiliary Field: 10V  2nd Auxiliary Field: ±20%  [SMDC0402]  (hidden comment: CAP CER 10UF 10V X5R 0402)
C29  value 0.10µF  1st Auxiliary Field: 16V  [SMDC0402]  (hidden comment: CAP CER 0.1UF 16V X7R 0402)
C30  value 1µF  [SMDC0402]  (hidden comment: CAP CER 1UF 16V X5R 0402)
C31  value 1µF  [SMDC0402]  (hidden comment: CAP CER 1UF 16V X5R 0402)
D1  value SM1204BC  [LED-SM1204BC]  (hidden comment: LED GREEN/RED CLEAR 1204 SMD R/A)
FID1  FID40X40  [FID40X40]  (value not drawn)
FID2  FID40X40  [FID40X40]  (value not drawn)
FID3  FID40X40  [FID40X40]  (value not drawn)
FID4  FID40X40  [FID40X40]  (value not drawn)
GND  TEST POINT  [TP_40X40]  (value not drawn)
GND1  TEST POINT  [TP_40X40]  (value not drawn)
J2  value S2B-PH-K-S(LF)(SN)  [SHDRRA2W70P0_200_1X2_590X790X550P]  (hidden comment: CONN HOUSING PH 2POS 2MM WHITE)
J3  value 10118194-0001LF  [USB_MICRO_B_10118194-0001LF]  (hidden comment: CONN USB MICRO B RECPT SMT R/A)
MH1  Mounting hole  [MH_2P2MM_3P6KP]  (value not drawn)
MH2  Mounting hole  [MH_2P2MM_3P6KP]  (value not drawn)
R23  value 100K  [SMDRC0402]  (hidden comment: RES SMD 100K OHM 1% 1/10W 0402)
R24  value 10K  [SMDR0402]  (hidden comment: RES SMD 10K OHM 1% 1/10W 0402)
R25  value 1.5K  [SMDR0402]  (hidden comment: RES SMD 1.5K OHM 1% 1/10W 0402)
R26  value 1.5K  [SMDR0402]  (hidden comment: RES SMD 1.5K OHM 1% 1/10W 0402)
R27  value 10K  [SMDR0402]  (hidden comment: RES SMD 10K OHM 1% 1/10W 0402)
R28  value 16.5K  1st Auxiliary Field: 0.1W  2nd Auxiliary Field: ±1%  [SMDR0402]  (hidden comment: RES SMD 16.5K OHM 1% 1/10W 0402)
R29  value 13.3K  1st Auxiliary Field: 0.1W  2nd Auxiliary Field: ±1%  [SMDR0402]  (hidden comment: RES SMD 13.3K OHM 1% 1/10W 0402)
R30  value 100K  [SMDRC0402]  (hidden comment: RES SMD 100K OHM 1% 1/10W 0402)
SB1  EMS_SB0805  [SB_0805]  (value not drawn)  (net tie, no BOM)
SW1  value CL-SB-12A-11T  [SWITCH_CLSB12A11T]  (hidden comment: SWITCH SLIDE SPDT 200MA 12V)
U3  value AAT3693IDH-AA-T1  [SON40P220X220x80_HS-11N]  (hidden comment: 1.6A LINEAR LI-ION CHGR 10TDFN)
U4  Manufacturer Part Number: MCP1711T-33I/OT  [SOT95P350X145-5N]  (hidden comment: IC REG LINEAR 3.3V 150MA SOT23-5)

### Ports
+3V3

### Nets
+3V3: +3V3.1 C31.2 U4.5(Vout) ; port +3V3
GND: C27.2 C28.2 C29.1 C30.1 C31.1 GND.1 GND1.1 J2.2 J3.5(GND) J3.6(SH1) J3.7(SH2) J3.8(SH3) J3.9(SH4) J3.10(SH5) J3.11(SH6) R27.2 R28.1 R29.2 U3.5(GND) U3.11(EP) U4.2(GND)
VBAT: C28.1 J2.1 SW1.2 U3.10(BAT)
VBUS_5V: C27.1 D1.1(A) J3.1(VBUS) R23.1 R24.1 U3.1(VIN)
NetC29_2: C29.2 U3.6(CT)
NetC30_2: C30.2 R30.2 SB1.2 U4.1(Vin)
NetD1_2: D1.2(K) R25.2
NetD1_3: D1.3(K) R26.2
NetR23_2: R23.2 U3.4(EN)
NetR24_2: R24.2 R27.1 U3.9(TS)
NetR25_1: R25.1 U3.2(~{STAT1})
NetR26_1: R26.1 U3.3(~{STAT2})
NetR28_2: R28.2 U3.7(ISET)
NetR29_1: R29.1 U3.8(TERM)
NetR30_1: R30.1 U4.3(~{SHDN})
NetSB1_1: SB1.1 SW1.3

Not connected (* = marked no-connect by the designer): FID1 0*; FID2 0*; FID3 0*; FID4 0*; J3 2(D-)* 3(D+)* 4(NC)*; MH1 1*; MH2 1*; SW1 1*; U4 4(NC)*

### Notes on the sheet
- (near BATTERY) BATTERY & BATTERY CONNECTOR
- BATTERY CHARGER IC
- USB CONNECTOR
- Mounting Holes
- Fiducials
- (near FID2) TOP
- (near FID4) BOTTOM
- 3.3V LDO
- TOP
- (near GND1) BOTTOM
- Customer:
- Design Partner:
- THE INFORMATION CONTAINED IN THIS DOCUMENT IS PROPRIETARY OF CUSTOMER AND IS CONFIDENTIAL.
- ANY PRODUCTION IN PART OR WHOLE WITHOUT PRIOR WRITTEN AUTHORIZATION OF CUSTOMER IS PROHIBITED.
- Abhaya Global
- DRAWN:
- CHECKED:
- PROJECT NAME :
- SCHEMATIC NAME:
- A4
- Document Number:
- Revision:
- Information Technology Inc.
- APPROVED:
- DATE:
- SHEET:
- of

### Library data of the parts
+3V3 GND GND1 = EMS-TP40X40-S: 1st Auxiliary Field: Black; Component Height (mm): *; Manufacturer: *; Part Type: TEST POINT; Manufacturer Part Number: *; Internal Part Number: EMS-TP40X40-S
BATTERY = EMS-1578: Manufacturer: Adafruit Industries LLC; Vendor Part Number: 1528-1841-ND; 4th Auxiliary Field: 503035; Component Height (mm): 4.8mm; Vendor Name: Digi-Key; 2nd Auxiliary Field: 500mAh; 3rd Auxiliary Field: *; Internal Part Number: EMS-1578; Part Type: BATTERY LITHIUM 3.7V 500MAH; Temp Co: *; Manufacturer Part Number: 1578; 1st Auxiliary Field: 3.7V
C27 C28 = ECA10U0M10V0-SB: Manufacturer: Samsung Electro-Mechanics America, Inc.; Manufacturer Part Number: CL05A106MP5NUNC; Vendor Part Number: 1276-1450-1-ND; Component Height (mm): 0.70mm; Vendor Name: DigiKey; Part Type: CAP CER 10UF 10V X5R 0402; 3rd Auxiliary Field: *; Internal Part Number: ECA10U0M10V0-SB; Temp Co: X5R; 4th Auxiliary Field: *
C29 = ECA0U10K16V0-1-SB: as C4 on sheet AD8232 & TMP136; Temp Co: X7R; Internal Part Number: ECA0U10K16V0-1-SB; 3rd Auxiliary Field: *; Component Height (mm): *; Part Type: CAP CER 0.1UF 16V X7R 0402; 4th Auxiliary Field: *
C30 C31 = ECA1U00L16V0-SB: as C9 on sheet nRF52840; Part Type: CAP CER 1UF 16V X5R 0402; Internal Part Number: ECA1U00L16V0-SB; 4th Auxiliary Field: *; Temp Co: X5R; 1st Auxiliary Field: 16V
D1 = ELDGR2V0020M0-S: Manufacturer: Bivar Inc.; Vendor Part Number: 492-1228-1-ND; Vendor Name: Digi-Key; 2nd Auxiliary Field: 20mA Green, 20mA Red; 3rd Auxiliary Field: RoHS Compliant; Component Height (mm): 1.00mm; 1st Auxiliary Field: 2V Green, 2V Red; Part Type: LED GREEN/RED CLEAR 1204 SMD R/A; Manufacturer Part Number: SM1204BC; Internal Part Number: ELDGR2V0020M0-S; 4th Auxiliary Field: *; Temp Co: *
FID1-FID4 = FID_40X40
J2 = ECNJSTHE02-T: Vendor Part Number: 455-1719-ND; Manufacturer: JST Sales America Inc.; Vendor Name: Digi-Key; Component Height (mm): 4.8mm; Part Type: CONN HOUSING PH 2POS 2MM WHITE; 1st Auxiliary Field: 2 Pos; 2nd Auxiliary Field: 2mm; 3rd Auxiliary Field: *; Manufacturer Part Number: S2B-PH-K-S(LF)(SN); Internal Part Number: ECNJSTHE02-T; 4th Auxiliary Field: *; Temp Co: *
J3 = EINUSBBR06-S-1364: Manufacturer: Amphenol FCI; Vendor Part Number: 609-4618-1-ND; Component Height (mm): 3mm; 3rd Auxiliary Field: RoHS Compliant; Vendor Name: Digi-Key; Temp Co: -30°C ~ 80°C; 1st Auxiliary Field: USB - micro B; 2nd Auxiliary Field: 5 POS; Manufacturer Part Number: 10118194-0001LF; Part Type: CONN USB MICRO B RECPT SMT R/A; 4th Auxiliary Field: *; Internal Part Number: EINUSBBR06-S-1364
MH1 MH2 = EMS-MH2.2MM: Internal Part Number: EMS-MH2.2MM; Manufacturer: *; Manufacturer Part Number: *
R23 R30 = ERE100KG110-SB: as R18 on sheet AD8232 & TMP136; Part Type: RES SMD 100K OHM 1% 1/10W 0402; 3rd Auxiliary Field: *; 4th Auxiliary Field: *; Internal Part Number: ERE100KG110-SB; 2nd Auxiliary Field: ±1%
R24 R27 = ERE10K0G110-SB: as R19 on sheet AD8232 & TMP136; Part Type: RES SMD 10K OHM 1% 1/10W 0402; Internal Part Number: ERE10K0G110-SB; 2nd Auxiliary Field: ±1%
R25 R26 = ERE1K50G110-SB: Manufacturer: Panasonic Electronic Components; Manufacturer Part Number: ERJ-2RKF1501X; Vendor Part Number: P1.50KLCT-ND; Component Height (mm): 0.40mm; Vendor Name: Digi-Key; Temp Co: ±100ppm/°C; 1st Auxiliary Field: 0.1W; Part Type: RES SMD 1.5K OHM 1% 1/10W 0402; Internal Part Number: ERE1K50G110-SB; 2nd Auxiliary Field: ±1%
R28 = ERE16K5G110-SB: Manufacturer Part Number: ERJ-2RKF1652X; Manufacturer: Panasonic Electronic Components; Vendor Part Number: P16.5KLCT-ND; Component Height (mm): 0.40mm; Vendor Name: Digi-Key; Temp Co: ±100ppm/°C; Part Type: RES SMD 16.5K OHM 1% 1/10W 0402; 3rd Auxiliary Field: *; 4th Auxiliary Field: *; Internal Part Number: ERE16K5G110-SB
R29 = ERE13K3G110-SB: Manufacturer: Panasonic Electronic Components; Vendor Part Number: P13.3KLCT-ND; Manufacturer Part Number: ERJ-2RKF1332X; Component Height (mm): 0.40mm; Vendor Name: Digi-Key; Temp Co: ±100ppm/°C; Part Type: RES SMD 13.3K OHM 1% 1/10W 0402; 3rd Auxiliary Field: *; 4th Auxiliary Field: *; Internal Part Number: ERE13K3G110-SB
SB1 = EMS_SB0805: *; Manufacturer: *; Part Type: *; Vendor Name: *; Vendor Part Number: *; 3rd Auxiliary Field: *; Manufacturer Part Number: *; Internal Part Number: EMS_SB0805; 4th Auxiliary Field: *; Component Height (mm): *; Temp Co: *; 2nd Auxiliary Field: *; 1st Auxiliary Field: *; Value: *
SW1 = EMS-CL-SB-12A-11T: Manufacturer: Nidec Copal Electronics; Vendor Part Number: 563-1316-1-ND; 3rd Auxiliary Field: ROHS3 Compliant; Component Height (mm): 3.5mm; Temp Co: -40°C ~ 85°C; Vendor Name: Digi-Key; 1st Auxiliary Field: 200mA (DC); 2nd Auxiliary Field: SPDT; 4th Auxiliary Field: *; Internal Part Number: EMS-CL-SB-12A-11T; Part Type: SWITCH SLIDE SPDT 200MA 12V; Manufacturer Part Number: CL-SB-12A-11T
U3 = EICSSTDFN-10-1864: Manufacturer: Skyworks Solutions Inc.; Vendor Part Number: 863-1512-1-ND; 3rd Auxiliary Field: ROHS3 Compliant; Component Height (mm): 0.8mm; Temp Co: -40°C ~ 85°C (TA); Vendor Name: Digi-Key; 1st Auxiliary Field: 7.5V; 2nd Auxiliary Field: 1.6A; 4th Auxiliary Field: *; Internal Part Number: EICSSTDFN-10-1864; Part Type: 1.6A LINEAR LI-ION CHGR 10TDFN; Manufacturer Part Number: AAT3693IDH-AA-T1
U4 = EICMTSOT23-5-****: Manufacturer: Microchip Technology; Vendor Part Number: MCP1711T-33I/OTCT-ND; 1st Auxiliary Field: 6V; 3rd Auxiliary Field: RoHS Compliant; Component Height (mm): 1.45mm; Temp Coefficient: -40°C ~ 85°C; Value: MCP1711T-33I/OT; Vendor: Digi-Key; 2nd Auxiliary Field: 150mA; 4th Auxiliary Field: 3.3V; Internal Part Number: EICMTSOT23-5-****; Part Type: IC REG LINEAR 3.3V 150MA SOT23-5

## Nets that join several sheets
+3V3: AD8232 & TMP136 (SB2.1), nRF52840 (SB3.1), USB & Battery Charging (+3V3.1 C31.2 U4.5)
GND: AD8232 & TMP136 (10 pins), nRF52840 (28 pins), USB & Battery Charging (21 pins)
VCC_3V3: AD8232 & TMP136 (13 pins), nRF52840 (D4.1)
LOD+: AD8232 & TMP136 (LOD+.1 U1.12), nRF52840 (U2.A20)
LOD-: AD8232 & TMP136 (LOD-.1 U1.11), nRF52840 (U2.B19)
n_SDN: AD8232 & TMP136 (R19.2 U1.13), nRF52840 (U2.L1)
SIGNAL_OUT: AD8232 & TMP136 (C7.1 OUT.1 R20.2 U1.10), nRF52840 (U2.A12)
TEMP_CENTIGRADE_OUT: AD8232 & TMP136 (R33.2 U5.2), nRF52840 (U2.A10)
TEMP_FAHRENHEIT_OUT: AD8232 & TMP136 (R33.1 R34.2), nRF52840 (R35.2)